# EAGLE schematic Main_Schematic (EAGLE 9.7.0)

## Sheet 1 of 4
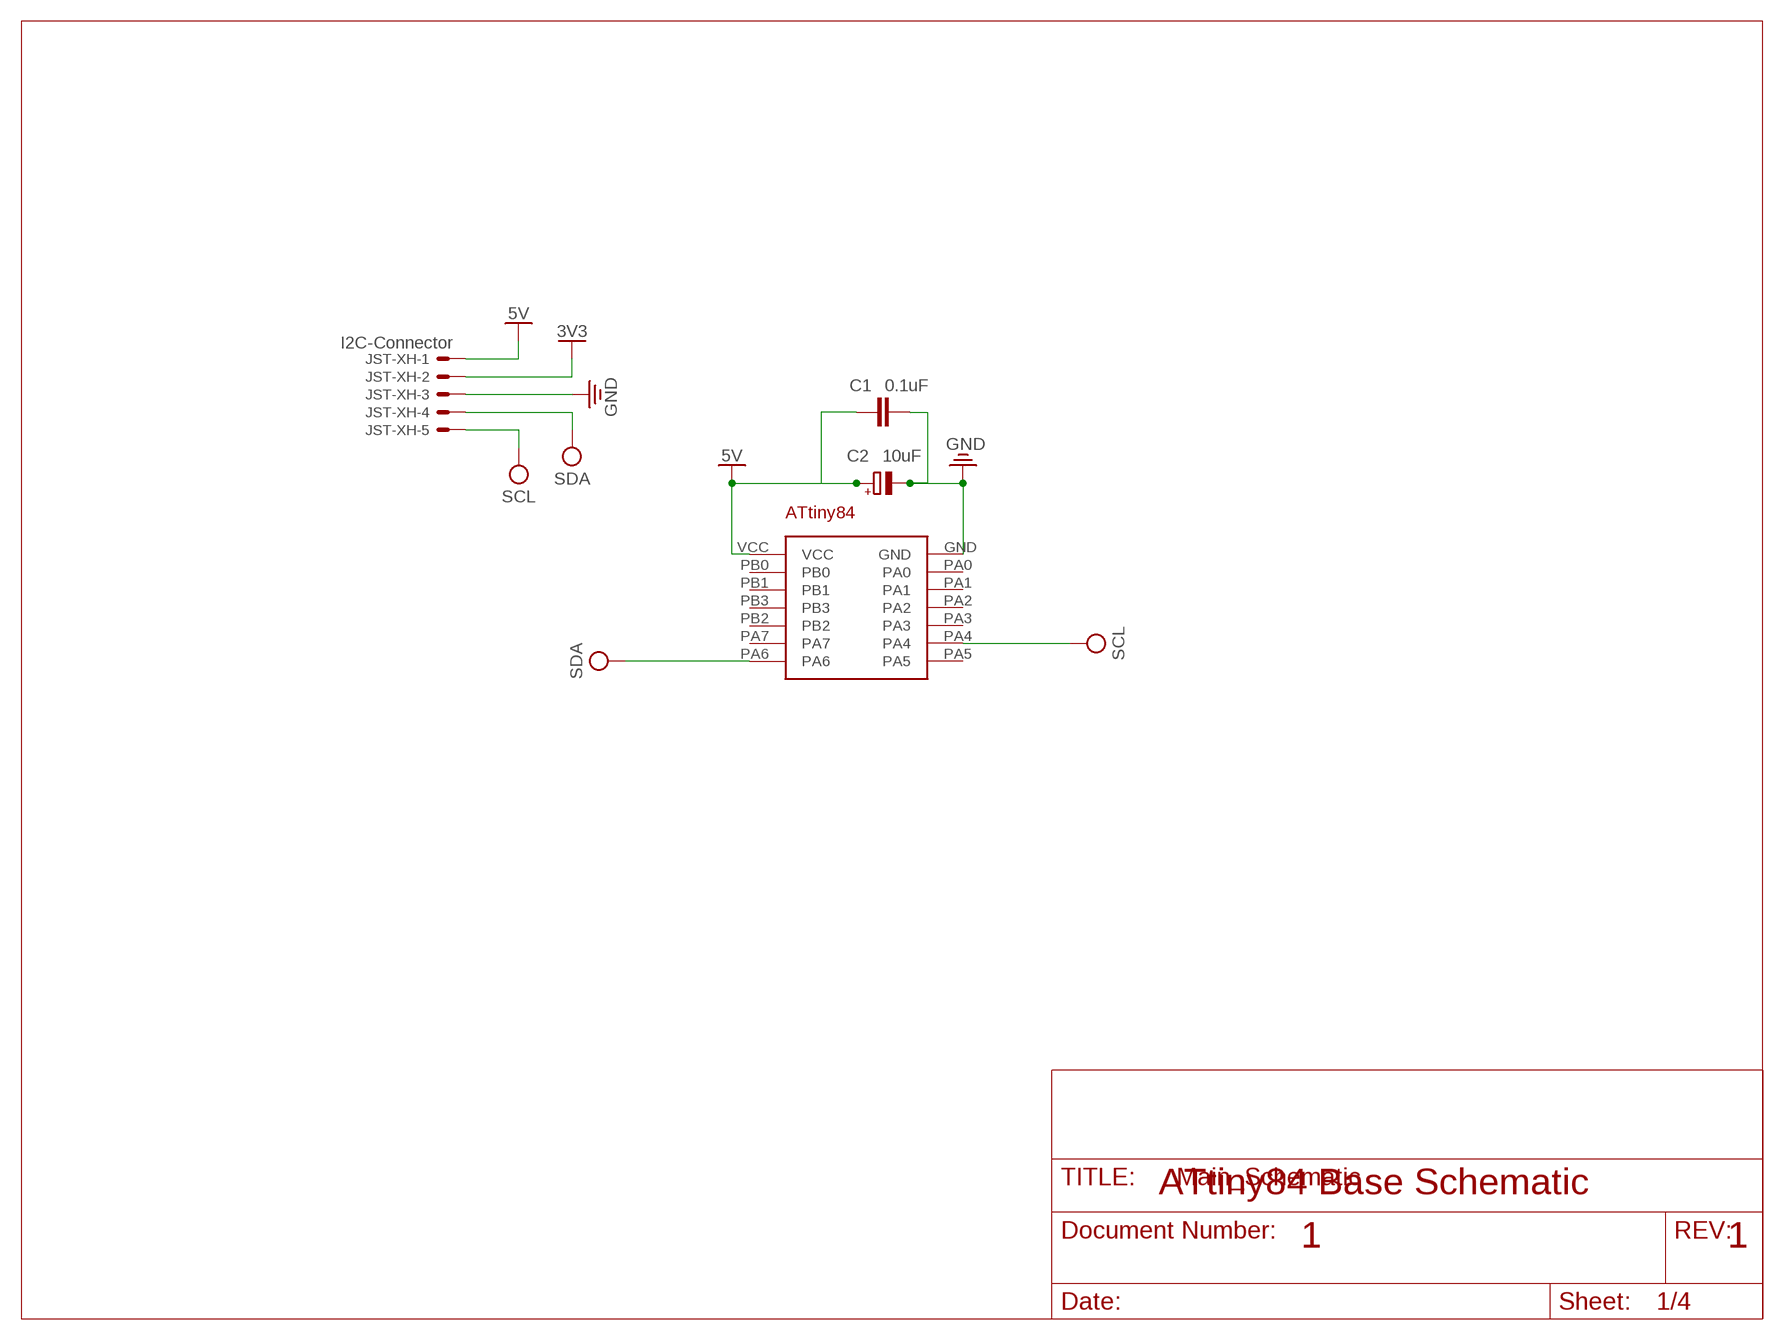
[diagram p0: schematic, sheet 1]

### Parts
C1  0.1uF  C-EU025-025X050  [C025-025X050]
C2  10uF  CPOL-EUE5-10.5  [E5-10,5]
JST-XH  I2C-Connector  JST-XH-05-PIN-LONG-PAD  [JST-XH-05-PACKAGE-LONG-PAD]
U$1  ATTINY84DIP  [ATTINY84(DIP)]

### Nets
3V3: JST-XH.2 ; also sheet 2,3,4
5V: C1.1 C2.+ JST-XH.1 U$1.VCC ; also sheet 2,3,4
GND: C1.2 C2.- JST-XH.3 U$1.GND ; also sheet 2,3,4
SCL: JST-XH.5 U$1.PA4 ; also sheet 2,3,4
SDA: JST-XH.4 U$1.PA6 ; also sheet 2,3,4
Unconnected: U$1.PA0 U$1.PA1 U$1.PA2 U$1.PA3 U$1.PA5 U$1.PA7 U$1.PB0 U$1.PB1 U$1.PB2 U$1.PB3

### Notes on the sheet
- ATtiny84 Base Schematic
- 1 | 1

## Sheet 2 of 4
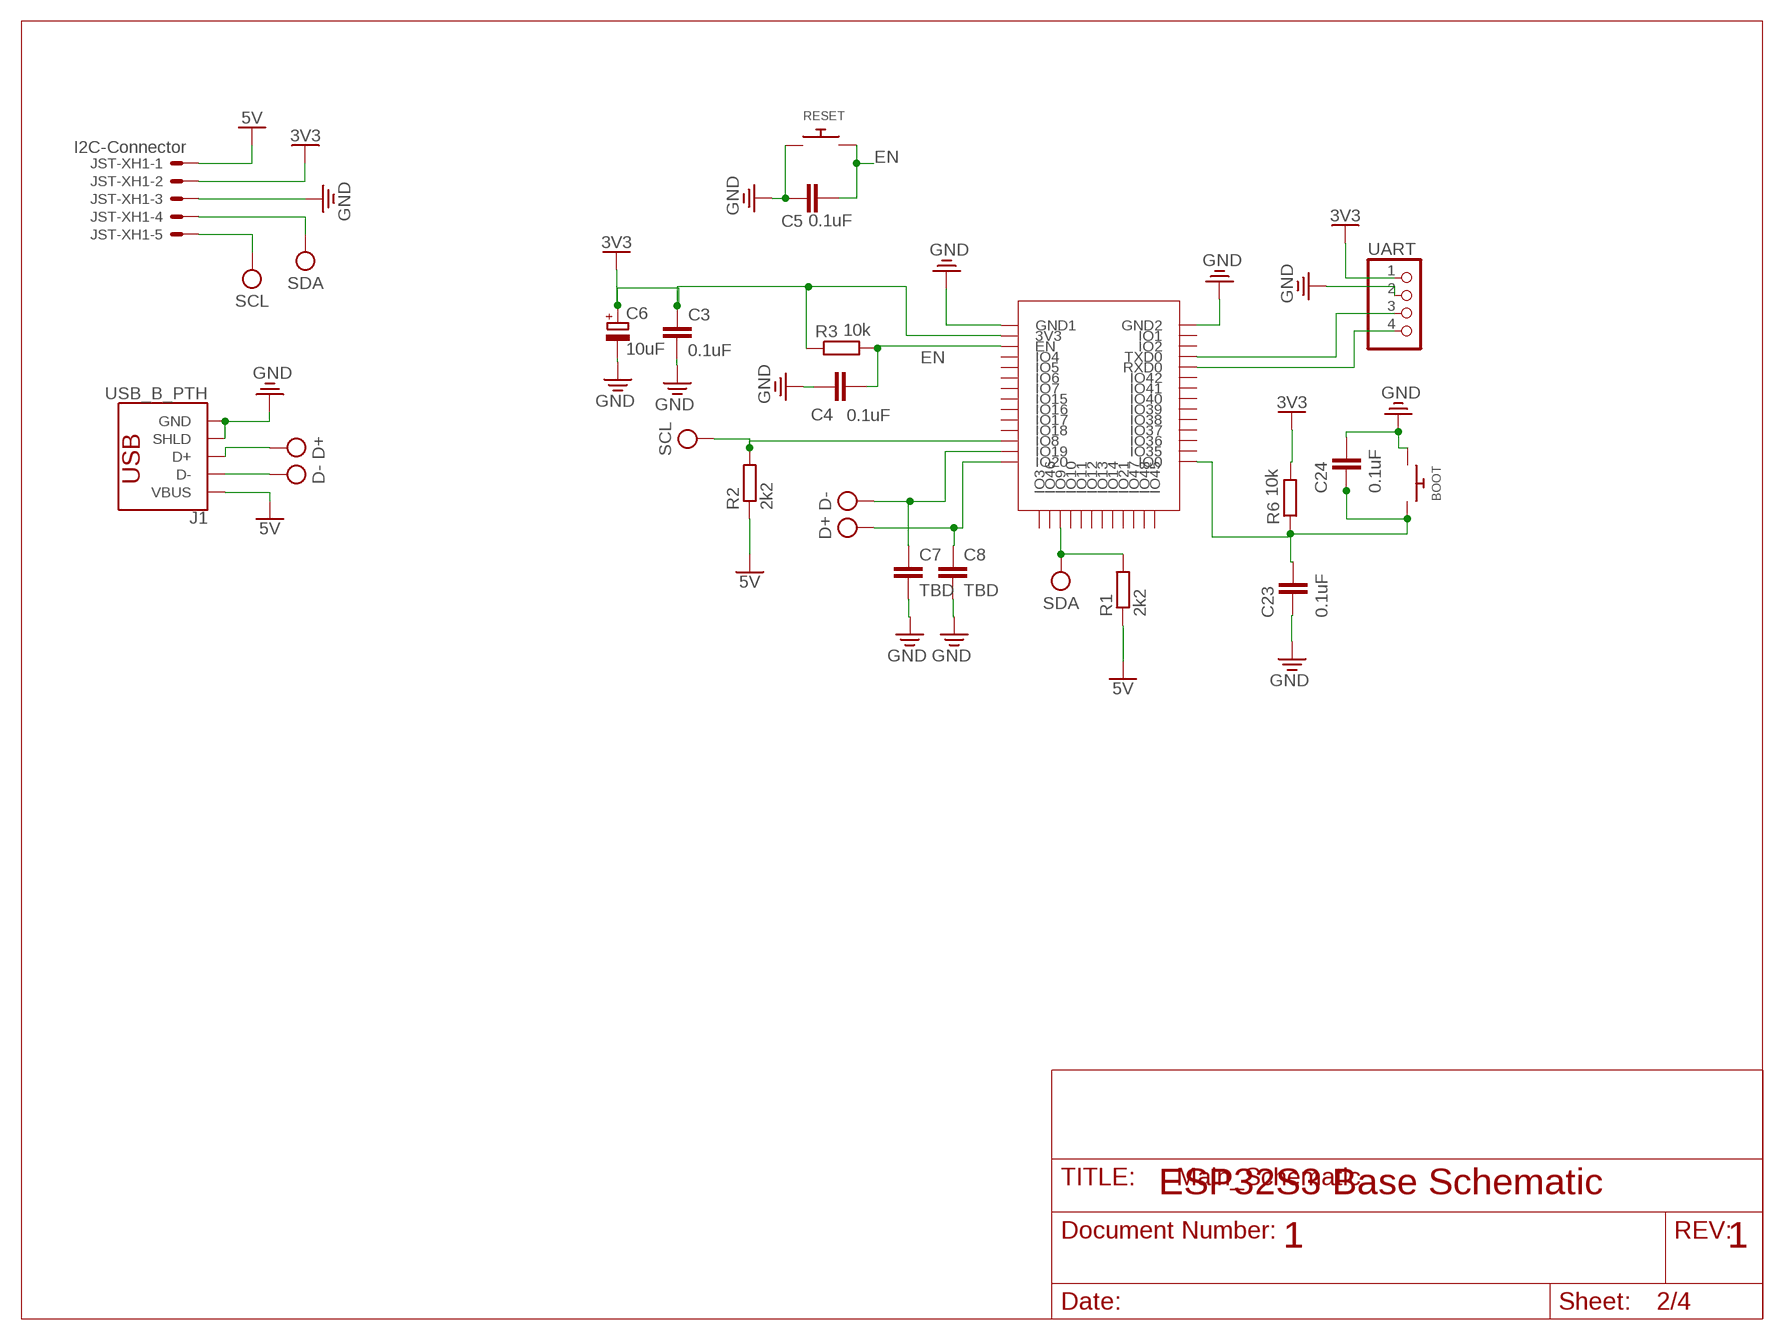
[diagram p1: schematic, sheet 2]

### Parts
BOOT  SWITCH_PUSHBUTTONEVQ-PE  [TACT_PANA-EVQ]
C3  0.1uF  C-EU025-030X050  [C025-030X050]
C4  0.1uF  C-EU025-030X050  [C025-030X050]
C5  0.1uF  C-EU025-030X050  [C025-030X050]
C6  10uF  C-POL_RADIAL-11MM-DIA  [CAPPRD508W65D1000H1100B]
C7  TBD  C-EU025-030X050  [C025-030X050]
C8  TBD  C-EU025-030X050  [C025-030X050]
C23  0.1uF  C-EU025-030X050  [C025-030X050]
C24  0.1uF  C-EU025-030X050  [C025-030X050]
J1  USB_B_PTH  [USB-B-PTH]
JST-XH1  I2C-Connector  JST-XH-05-PIN-LONG-PAD  [JST-XH-05-PACKAGE-LONG-PAD]
R1  2k2  R-EU_0204/5  [0204/5]
R2  2k2  R-EU_0204/5  [0204/5]
R3  10k  R-EU_0204/7  [0204/7]
R6  10k  R-EU_0204/7  [0204/7]
RESET  SWITCH_PUSHBUTTONEVQ-PE  [TACT_PANA-EVQ]
U$2  ESP32-S3-WROOM  [ESP32-S3-WROOM]
UART  PINHD-1X4  [1X04]

### Nets
3V3: C3.1 C6.1(+) JST-XH1.2 R3.1 R6.2 U$2.3V3 UART.1 ; also sheet 1,3,4
5V: J1.VBUS JST-XH1.1 R1.1 R2.1 ; also sheet 1,3,4
D+: C8.1 J1.D+ U$2.IO20
D-: C7.1 J1.D- U$2.IO19
EN: C4.2 C5.2 R3.2 RESET.P$2 U$2.EN
GND: BOOT.P$1 C3.2 C4.1 C5.1 C6.2(-) C7.2 C8.2 C23.1 C24.2 J1.GND J1.SHLD1(SHLD) J1.SHLD2(SHLD) JST-XH1.3 RESET.P$1 U$2.GND2 UART.2 ; also sheet 1,3,4
N$1: U$2.TXD0 UART.3
N$2: U$2.GND1 ; supply symbol labelled GND
N$3: U$2.RXD0 UART.4
N$9: BOOT.P$2 C23.2 C24.1 R6.1 U$2.IO0
SCL: JST-XH1.5 R2.2 U$2.IO8 ; also sheet 1,3,4
SDA: JST-XH1.4 R1.2 U$2.IO9 ; also sheet 1,3,4
Unconnected: U$2.IO1 U$2.IO2 U$2.IO3 U$2.IO4 U$2.IO5 U$2.IO6 U$2.IO7 U$2.IO10 U$2.IO11 U$2.IO12 U$2.IO13 U$2.IO14 U$2.IO15 U$2.IO16 U$2.IO17 U$2.IO18 U$2.IO21 U$2.IO35 U$2.IO36 U$2.IO37 U$2.IO38 U$2.IO39 U$2.IO40 U$2.IO41 U$2.IO42 U$2.IO45 U$2.IO46 U$2.IO47 U$2.IO48

### Notes on the sheet
- ESP32S3 Base Schematic
- 1 | 1

## Sheet 3 of 4
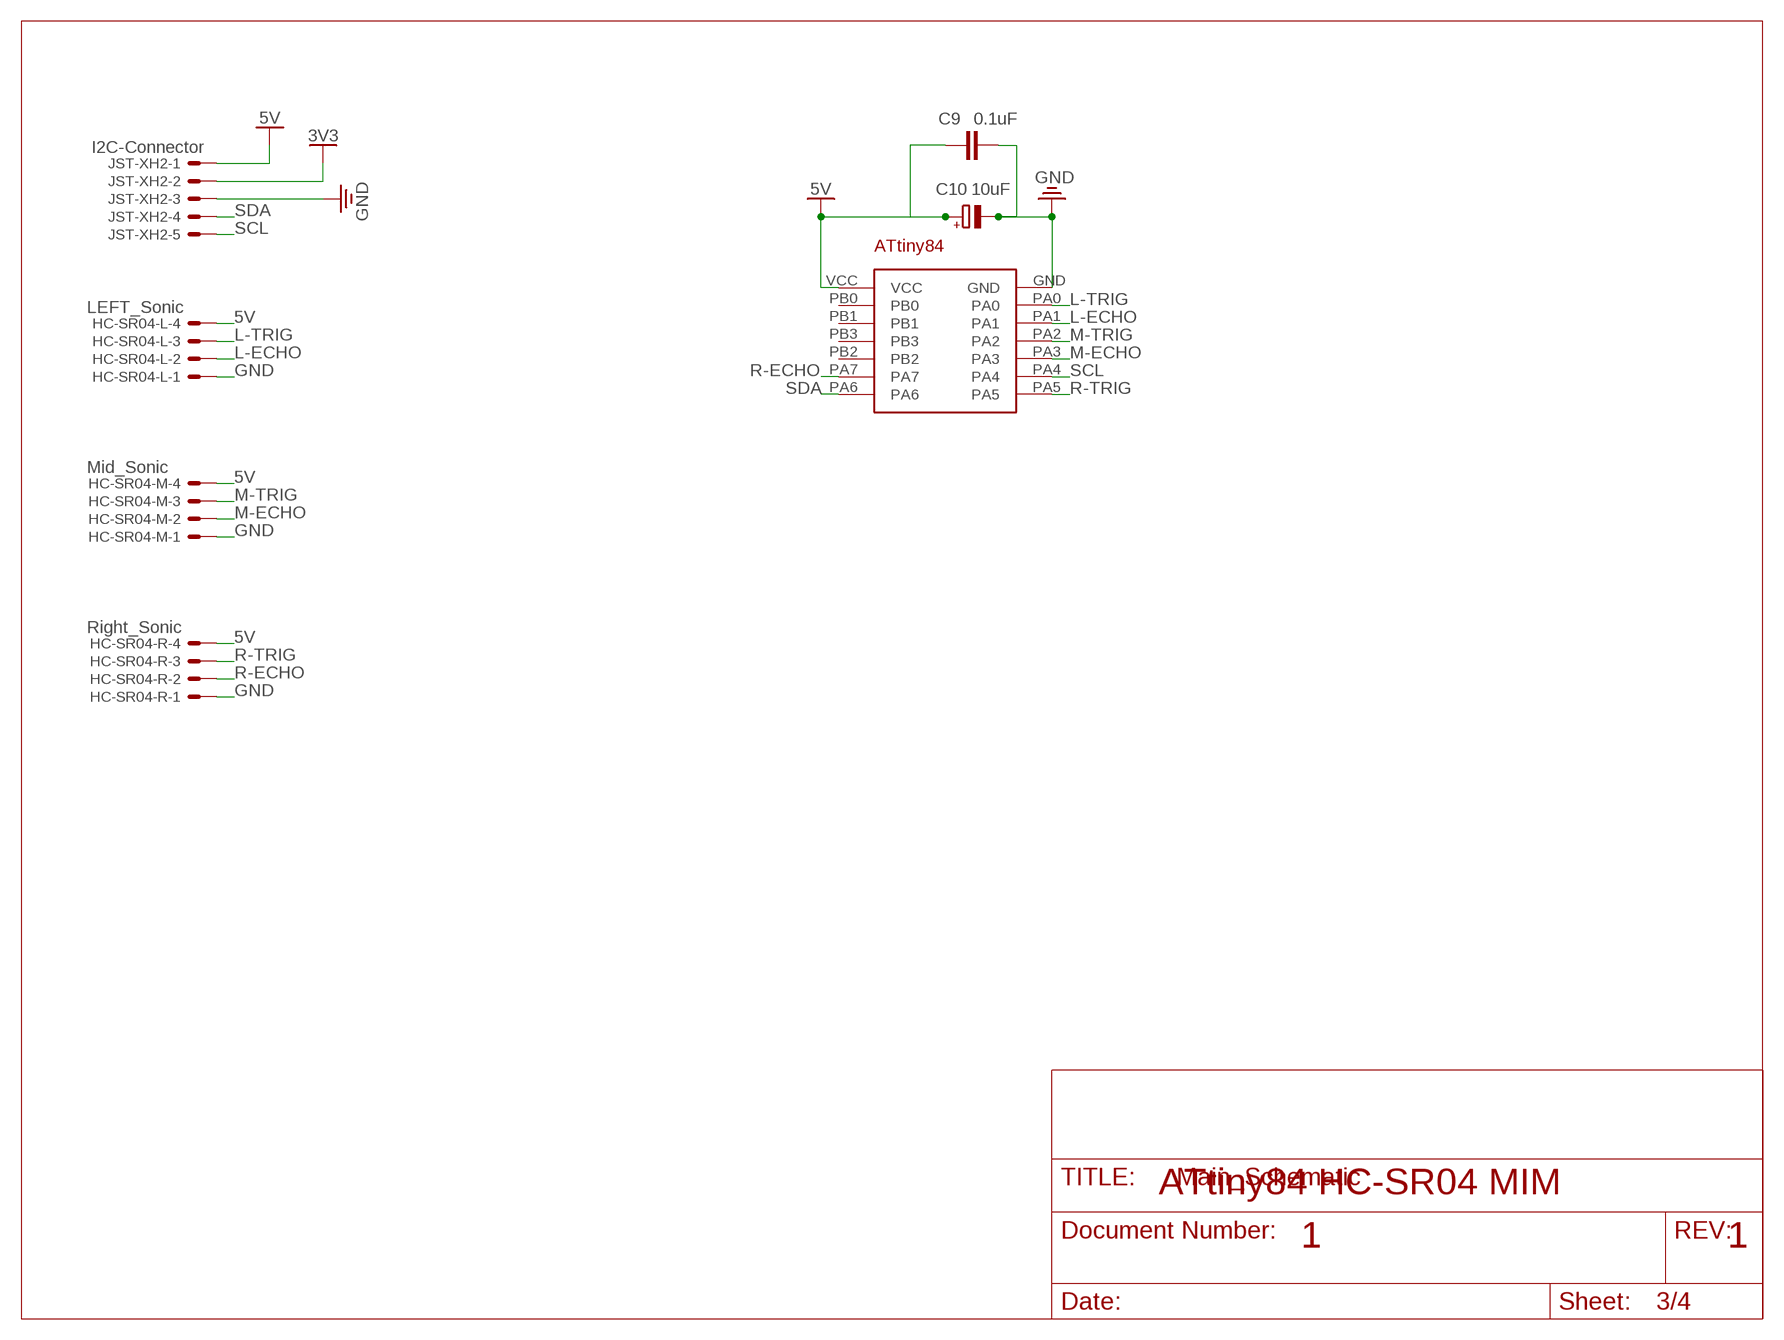
[diagram p2: schematic, sheet 3]

### Parts
C9  0.1uF  C-EU025-025X050  [C025-025X050]
C10  10uF  CPOL-EUE5-10.5  [E5-10,5]
HC-SR04-L  LEFT_Sonic  JST-XH-04-PIN-LONG-PAD  [JST-XH-04-PACKAGE-LONG-PAD]
HC-SR04-M  Mid_Sonic  JST-XH-04-PIN-LONG-PAD  [JST-XH-04-PACKAGE-LONG-PAD]
HC-SR04-R  Right_Sonic  JST-XH-04-PIN-LONG-PAD  [JST-XH-04-PACKAGE-LONG-PAD]
JST-XH2  I2C-Connector  JST-XH-05-PIN-LONG-PAD  [JST-XH-05-PACKAGE-LONG-PAD]
U$3  ATTINY84DIP  [ATTINY84(DIP)]

### Nets
3V3: JST-XH2.2 ; also sheet 1,2,4
5V: C9.1 C10.+ HC-SR04-L.4 HC-SR04-M.4 HC-SR04-R.4 JST-XH2.1 U$3.VCC ; also sheet 1,2,4
GND: C9.2 C10.- HC-SR04-L.1 HC-SR04-M.1 HC-SR04-R.1 JST-XH2.3 U$3.GND ; also sheet 1,2,4
L-ECHO: HC-SR04-L.2 U$3.PA1
L-TRIG: HC-SR04-L.3 U$3.PA0
M-ECHO: HC-SR04-M.2 U$3.PA3
M-TRIG: HC-SR04-M.3 U$3.PA2
R-ECHO: HC-SR04-R.2 U$3.PA7
R-TRIG: HC-SR04-R.3 U$3.PA5
SCL: JST-XH2.5 U$3.PA4 ; also sheet 1,2,4
SDA: JST-XH2.4 U$3.PA6 ; also sheet 1,2,4
Unconnected: U$3.PB0 U$3.PB1 U$3.PB2 U$3.PB3

### Notes on the sheet
- ATtiny84 HC-SR04 MIM
- 1 | 1

## Sheet 4 of 4
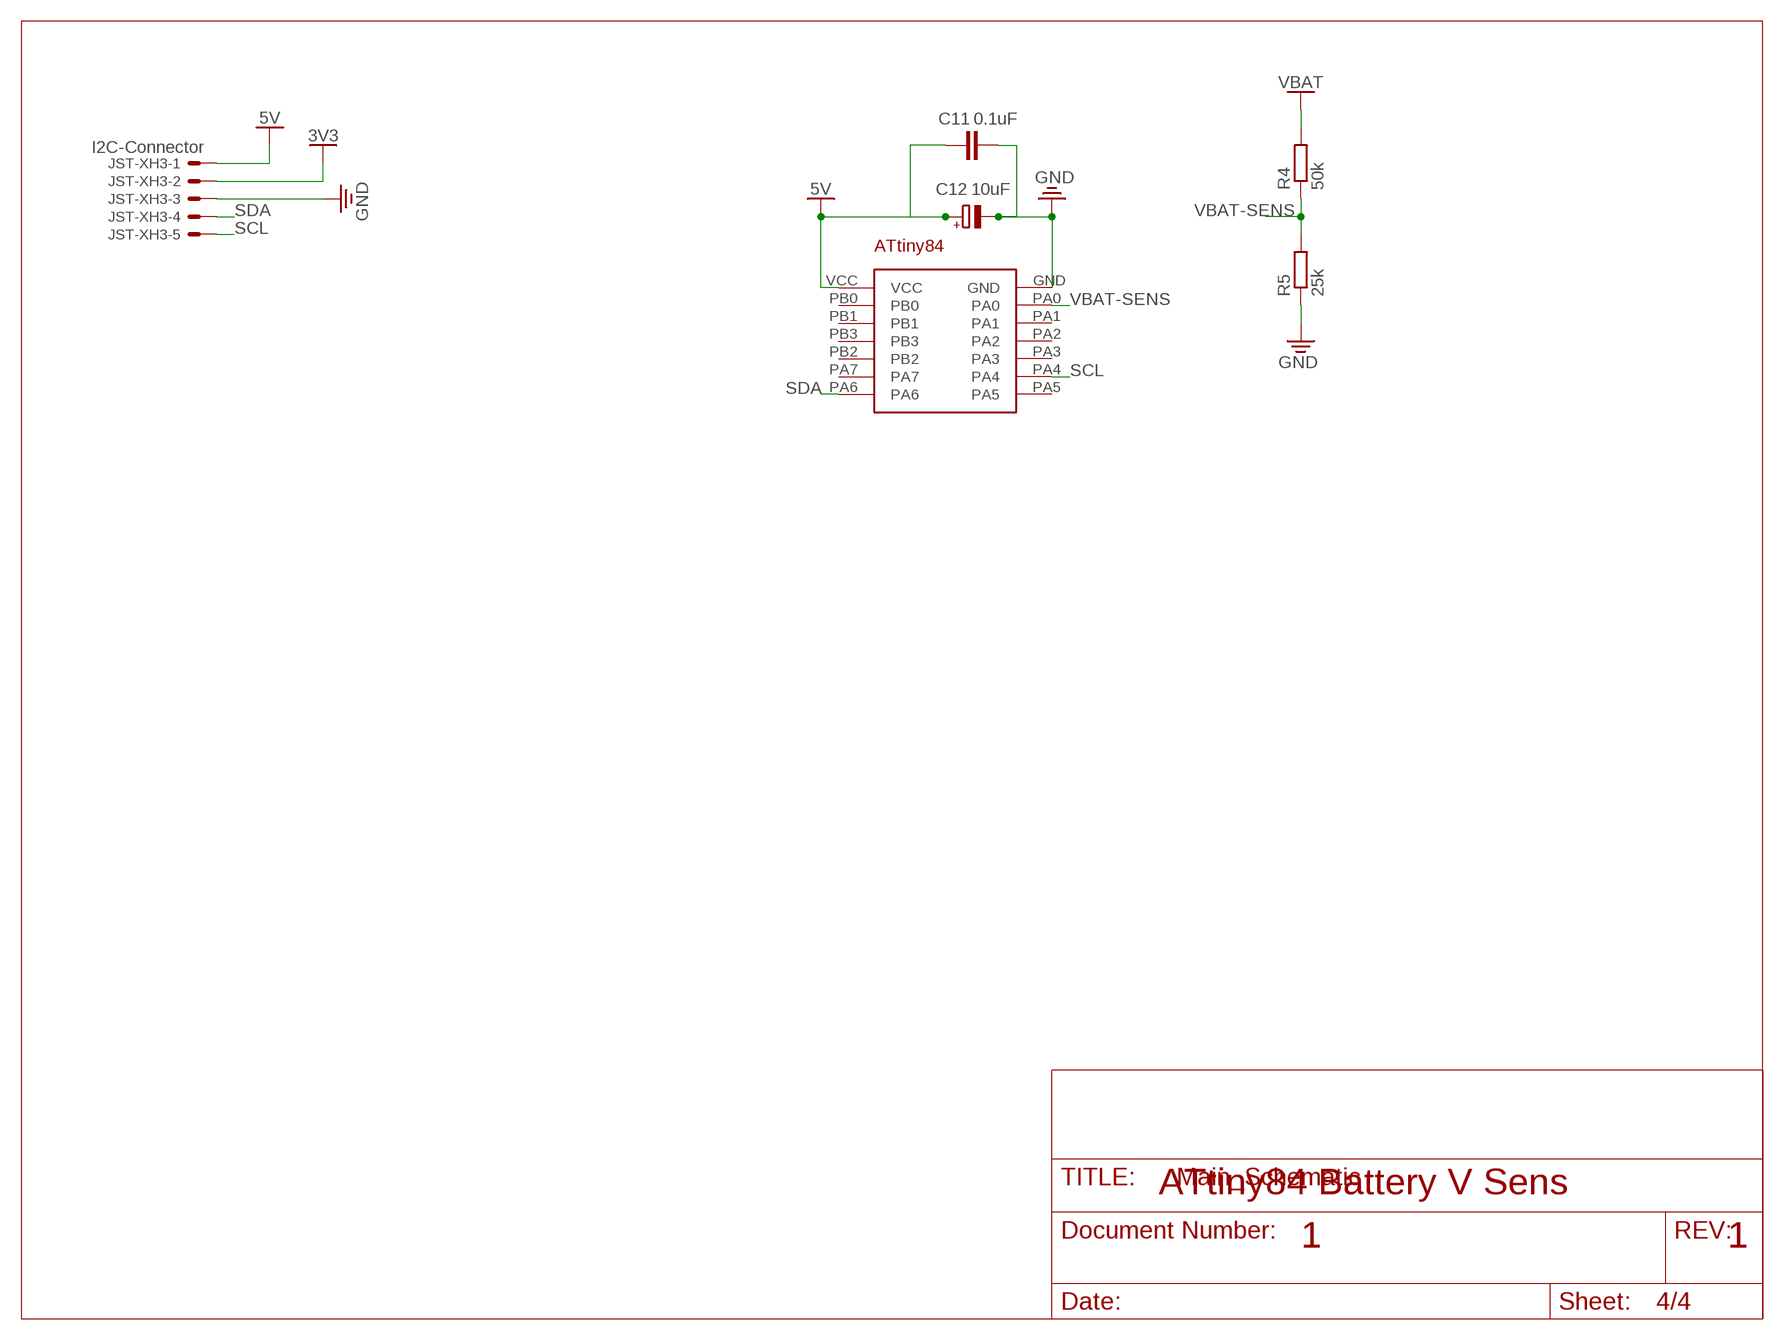
[diagram p3: schematic, sheet 4]

### Parts
C11  0.1uF  C-EU025-025X050  [C025-025X050]
C12  10uF  CPOL-EUE5-10.5  [E5-10,5]
JST-XH3  I2C-Connector  JST-XH-05-PIN-LONG-PAD  [JST-XH-05-PACKAGE-LONG-PAD]
R4  50k  R-EU_0204/5  [0204/5]
R5  25k  R-EU_0204/5  [0204/5]
U$4  ATTINY84DIP  [ATTINY84(DIP)]

### Nets
3V3: JST-XH3.2 ; also sheet 1,2,3
5V: C11.1 C12.+ JST-XH3.1 U$4.VCC ; also sheet 1,2,3
GND: C11.2 C12.- JST-XH3.3 R5.1 U$4.GND ; also sheet 1,2,3
SCL: JST-XH3.5 U$4.PA4 ; also sheet 1,2,3
SDA: JST-XH3.4 U$4.PA6 ; also sheet 1,2,3
VBAT: R4.2
VBAT-SENS: R4.1 R5.2 U$4.PA0
Unconnected: U$4.PA1 U$4.PA2 U$4.PA3 U$4.PA5 U$4.PA7 U$4.PB0 U$4.PB1 U$4.PB2 U$4.PB3

### Notes on the sheet
- ATtiny84 Battery V Sens
- 1 | 1

## Library data of the parts
BOOT RESET = adafruit:SWITCH_PUSHBUTTON: Buttons SOFTTOUCHSMD_SJ - Soft touch temporary push button (Super Junk Akihabara) Compatible with SKPMANE010 [Mouser: 688-SKPMAN] C&K_KSS = Digikey: KSS221GLFS
C1 C3-C5 C7-C9 C11 C23 C24 = rcl:C-EU: CAPACITOR, European symbol; SPICEPREFIX: C
C2 C10 C12 = rcl:CPOL-EU: POLARIZED CAPACITOR, European symbol; SPICEPREFIX: C
C6 = Capacitor:C-POL: Capacitor Polarised - Generic; CATEGORY: Capacitor
HC-SR04-L HC-SR04-M HC-SR04-R = Rembrandt Electronics - JST XH Connectors v1-0:JST-XH-04-PIN: JST XH Connector 2 Pin Wire to board connector. Pitch: 2,54 mm, (0.100") Number of pins: 4 Created by Rembrandt Electronics www.rembrandtelectronics.com
J1 = SparkFun-Connectors:USB_B: USB Type B Connector SparkFun Products: SparkFun Stepoko <https://www.sparkfun.com/products/13899> PTH; PROD_ID: CONN-08278; SF_ID: PRT-00139
JST-XH JST-XH1-JST-XH3 = Rembrandt Electronics - JST XH Connectors v1-0:JST-XH-05-PIN: JST XH Connector 2 Pin Wire to board connector. Pitch: 2,54 mm, (0.100") Number of pins: 5 Created by Rembrandt Electronics www.rembrandtelectronics.com
R1-R6 = rcl:R-EU_: RESISTOR, European symbol; SPICEPREFIX: R
U$1 U$3 U$4 = RobotMower_Eagle_Library:ATTINY84
U$2 = ESP32:ESP32-S3-WROOM
UART = Connector:PINHD-1X4: PIN HEADER; CATEGORY: Headers; DESCRIPTION: Header, Straight, 4 Position; MANUFACTURER: Generic; MPN: Generic; OPERATING_TEMPERATURE: Generic; PART_STATUS: Active; PITCH: 0.100" (2.54mm); ROHS_COMPLIANCE: Generic; SERIES: Generic; SUB-CATEGORY: Headers, Male Pins; TYPE: Board to Board or Cable, Unshrouded, Through Hole, Straight